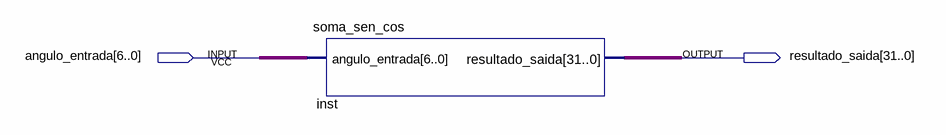
[diagram p0: schematic sheet]
// Quartus schematic Block1.bdf as structural Verilog: 1 symbols, 2 pins
module Block1 (
  input  [6:0] angulo_entrada,
  output [31:0] resultado_saida
);

  soma_sen_cos inst (.angulo_entrada(angulo_entrada), .resultado_saida(resultado_saida));
endmodule
